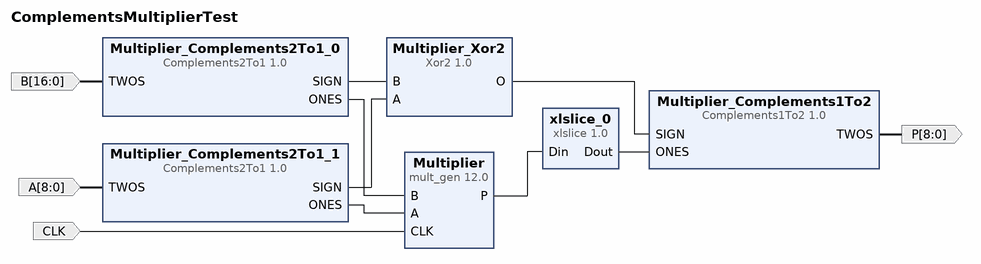
[diagram p0: block diagram of the top level]
# Vivado block design ComplementsMultiplierTest, Vivado 2014.2
create_bd_design ComplementsMultiplierTest

create_bd_port -dir I -type clk CLK
create_bd_port -dir I -from 8 -to 0 -type data A
create_bd_port -dir I -from 16 -to 0 -type data B
create_bd_port -dir O -from 8 -to 0 P

create_bd_cell -type ip -vlnv xilinx.com:ip:mult_gen:12.0 Multiplier
set_property -dict [list \
  CONFIG.PortAType Signed \
  CONFIG.PortAWidth 8 \
  CONFIG.PortBType Signed \
  CONFIG.PortBWidth 16 \
  CONFIG.Use_Custom_Output_Width true \
] [get_bd_cells Multiplier]
create_bd_cell -type ip -vlnv oloftus.com:prif:Xor2:1.0 Multiplier_Xor2
create_bd_cell -type ip -vlnv xilinx.com:ip:xlslice:1.0 xlslice_0
set_property -dict {CONFIG.DIN_TO 8 CONFIG.DIN_FROM 15 CONFIG.DIN_WIDTH 24} [get_bd_cells xlslice_0]
create_bd_cell -type ip -vlnv oloftus.com:prif:Complements1To2:1.0 Multiplier_Complements1To2
set_property -dict {CONFIG.width 8} [get_bd_cells Multiplier_Complements1To2]
create_bd_cell -type ip -vlnv oloftus.com:prif:Complements2To1:1.0 Multiplier_Complements2To1_0
set_property -dict {CONFIG.width 16} [get_bd_cells Multiplier_Complements2To1_0]
create_bd_cell -type ip -vlnv oloftus.com:prif:Complements2To1:1.0 Multiplier_Complements2To1_1
set_property -dict {CONFIG.width 8} [get_bd_cells Multiplier_Complements2To1_1]

# ---- connections ----

connect_bd_net [get_bd_ports CLK] [get_bd_pins Multiplier/CLK]
connect_bd_net [get_bd_pins Multiplier_Complements2To1_0/ONES] [get_bd_pins Multiplier/B]
connect_bd_net [get_bd_pins Multiplier_Complements2To1_0/SIGN] [get_bd_pins Multiplier_Xor2/B]
connect_bd_net [get_bd_pins Multiplier_Complements2To1_1/ONES] [get_bd_pins Multiplier/A]
connect_bd_net [get_bd_pins Multiplier_Complements2To1_1/SIGN] [get_bd_pins Multiplier_Xor2/A]
connect_bd_net [get_bd_pins Multiplier/P] [get_bd_pins xlslice_0/Din]
connect_bd_net [get_bd_pins xlslice_0/Dout] [get_bd_pins Multiplier_Complements1To2/ONES]
connect_bd_net [get_bd_pins Multiplier_Xor2/O] [get_bd_pins Multiplier_Complements1To2/SIGN]
connect_bd_net [get_bd_ports B] [get_bd_pins Multiplier_Complements2To1_0/TWOS]
connect_bd_net [get_bd_ports A] [get_bd_pins Multiplier_Complements2To1_1/TWOS]
connect_bd_net [get_bd_pins Multiplier_Complements1To2/TWOS] [get_bd_ports P]

validate_bd_design
save_bd_design
